# Altium project SCSS_minimalDesign.PrjPcb
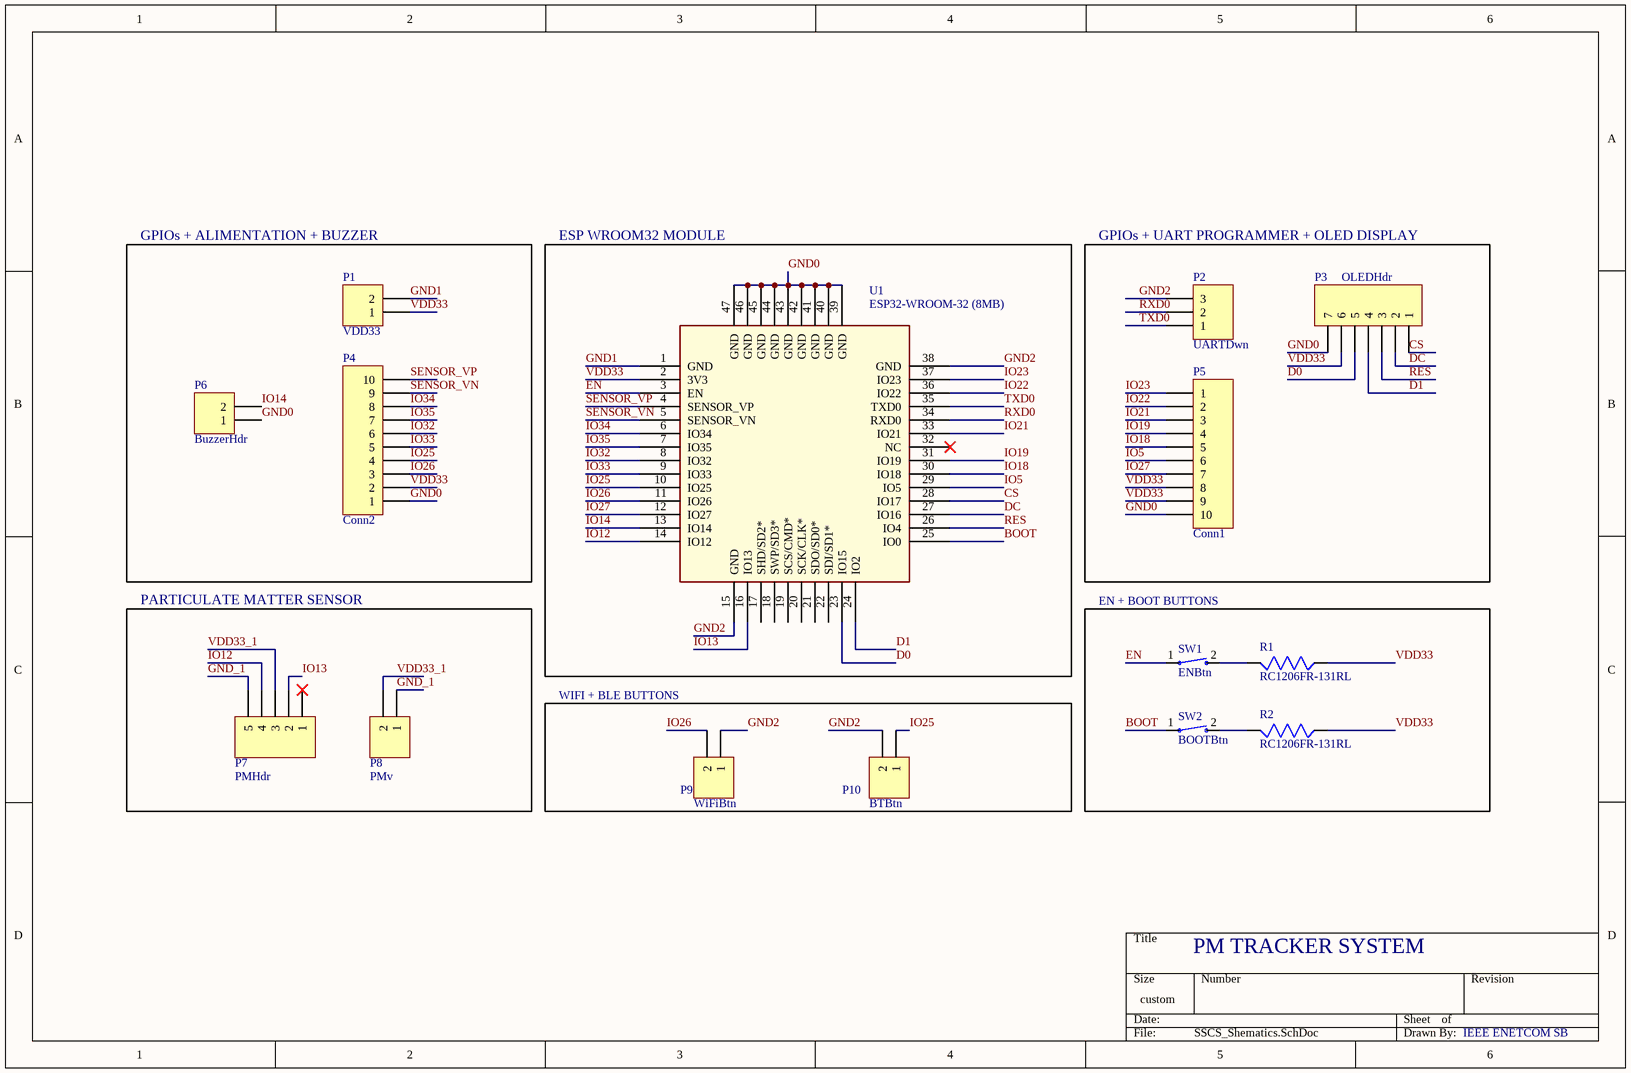
[diagram p0: SSCS_Shematics.SchDoc]
1 sheet, 15 parts. Net scope: global (net labels, ports and power ports of the same name join across sheets).
Board file: SSCS_PCB_2Layers.PcbDoc

## Sheet SSCS_Shematics.SchDoc
size 304 x 199 mm; SheetNumber: 1; SheetTotal: 1

### Parts
P1  VDD33  [Conn2x2.54]
P2  UARTDwn  [Conn3x2.54]
P3  OLEDHdr  [Conn7x2.54]
P4  Conn2  [Conn10x2.54]
P5  Conn1  [Conn10x2.54]
P6  BuzzerHdr  [Conn2x2.54Buzzer]
P7  PMHdr  [Conn5x2.54]
P8  PMv  [Conn2x2.54]
P9  WiFiBtn  [SW]
P10  BTBtn  [SW]
R1  RC1206FR-131RL  [res]
R2  RC1206FR-131RL  [res]
SW1  ENBtn  [SW]
SW2  BOOTBtn  [SW]
U1  ESP32-WROOM-32 (8MB)  [IC38_ESP32-WROOM-32 8MB_EXP]

### Blocks framed on the sheet
GPIOs + ALIMENTATION + BUZZER: P1 P4 P6
ESP WROOM32 MODULE: U1
GPIOs + UART PROGRAMMER + OLED DISPLAY: P2 P3 P5
PARTICULATE MATTER SENSOR: P7 P8
EN + BOOT BUTTONS: R1 R2 SW1 SW2
WIFI + BLE BUTTONS: P9 P10

### Nets
BOOT: SW2.1 U1.25(IO0)
CS: P3.1 U1.28(IO17)
D0: P3.5 U1.23(IO15)
D1: P3.4 U1.24(IO2)
DC: P3.2 U1.27(IO16)
EN: SW1.1 U1.3(EN)
GND0: P3.7 P4.1 P5.10 P6.1 U1.39(GND) U1.40(GND) U1.41(GND) U1.42(GND) U1.43(GND) U1.44(GND) U1.45(GND) U1.46(GND) U1.47(GND)
GND1: P1.2 U1.1(GND)
GND2: P2.3 P9.1 P10.2 U1.15(GND) U1.38(GND)
GND_1: P7.5 P8.1
IO5: P5.6 U1.29(IO5)
IO12: P7.4 U1.14(IO12)
IO13: P7.2 U1.16(IO13)
IO14: P6.2 U1.13(IO14)
IO18: P5.5 U1.30(IO18)
IO19: P5.4 U1.31(IO19)
IO21: P5.3 U1.33(IO21)
IO22: P5.2 U1.36(IO22)
IO23: P5.1 U1.37(IO23)
IO25: P4.4 P10.1 U1.10(IO25)
IO26: P4.3 P9.2 U1.11(IO26)
IO27: P5.7 U1.12(IO27)
IO32: P4.6 U1.8(IO32)
IO33: P4.5 U1.9(IO33)
IO34: P4.8 U1.6(IO34)
IO35: P4.7 U1.7(IO35)
RES: P3.3 U1.26(IO4)
RXD0: P2.2 U1.34(RXD0)
SENSOR_VN: P4.9 U1.5(SENSOR_VN)
SENSOR_VP: P4.10 U1.4(SENSOR_VP)
TXD0: P2.1 U1.35(TXD0)
VDD33: P1.1 P3.6 P4.2 P5.8 P5.9 R1.2 R2.2 U1.2(3V3)
VDD33_1: P7.3 P8.2
NetR1_1: R1.1 SW1.2
NetR2_1: R2.1 SW2.2

Not connected (* = marked no-connect by the designer): P7 1*; U1 17(SHD/SD2*) 18(SWP/SD3*) 19(SCS/CMD*) 20(SCK/CLK*) 21(SDO/SD0*) 22(SDI/SD1*) 32(NC)*

### Notes on the sheet
- PM TRACKER SYSTEM
- IEEE ENETCOM SB

### Library data of the parts
P1 P6 P8-P10 = MHDR1X2: Header, 2-Pin; LatestRevisionDate: 17-Jul-2002; LatestRevisionNote: Re-released for DXP Platform.; Publisher: Altium Limited
P2 = MHDR1X3: Header, 3-Pin; LatestRevisionDate: 17-Jul-2002; LatestRevisionNote: Re-released for DXP Platform.; Publisher: Altium Limited
P3 = MHDR1X7: Header, 7-Pin; LatestRevisionDate: 17-Jul-2002; LatestRevisionNote: Re-released for DXP Platform.; Publisher: Altium Limited
P4 P5 = MHDR1X10: Header, 10-Pin; LatestRevisionDate: 17-Jul-2002; LatestRevisionNote: Re-released for DXP Platform.; Publisher: Altium Limited
P7 = MHDR1X5: Header, 5-Pin; LatestRevisionDate: 17-Jul-2002; LatestRevisionNote: Re-released for DXP Platform.; Publisher: Altium Limited
R1 R2 = RC1206FR-131RL: RC Series 1206 0.25 W 0 O Jumper Surface Mount Thick Film Chip Resistor; Package: None; Price: None; Value: *; MP: RC1206FR-131RL; Availability: Unavailable
SW1 SW2 = 147873-1: Switch Tactile OFF (ON) SPST Rectangular Button J-Bend 0.05A 24VDC 1.77N SMD T/R; MF: TE Connectivity; SnapEDA_Link: https://www.snapeda.com/parts/147873-1/TE%20Connectivity%20ALCOSWITCH%20Switches/view-part/2549694/?ref=snap; Availability: Unavailable; Value: *; Price: None; MP: 147873-1; Package: None
U1 = ESP32-WROOM-32 8MB: No Description Available; Mfr_Name: Espressif Systems; Copyright: Copyright (C) 2023 Ultra Librarian. All rights reserved.; Manufacturer_Part_Number: ESP32-WROOM-32 (8MB); RefDes: RefDes; Type: DEV